# EAGLE design at2313 isp adapter (EAGLE 6.1)
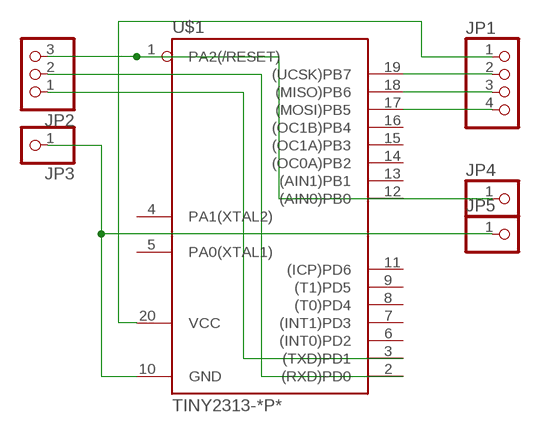
[diagram p0: schematic, sheet 1]

## Parts
JP1  PINHD-1X4  [1X04]
JP2  PINHD-1X3  [1X03]
JP3  PINHD-1X1  [1X01]
JP4  PINHD-1X1  [1X01]
JP5  PINHD-1X1  [1X01]
U$1  TINY2313-*P*  [DIL20]

## Nets
GND: JP3.1 JP5.1 U$1.10(GND)
N$1: JP1.2 U$1.19((UCSK)PB7)
N$2: JP1.3 U$1.18((MISO)PB6)
N$3: JP1.4 U$1.17((MOSI)PB5)
N$4: JP1.1 U$1.20(VCC)
N$6: JP2.3 JP4.1 U$1.1(PA2(/RESET))
N$7: JP2.2 U$1.2((RXD)PD0)
N$8: JP2.1 U$1.3((TXD)PD1)
Unconnected: U$1.4(PA1(XTAL2)) U$1.5(PA0(XTAL1)) U$1.6((INT0)PD2) U$1.7((INT1)PD3) U$1.8((T0)PD4) U$1.9((T1)PD5) U$1.11((ICP)PD6) U$1.12((AIN0)PB0) U$1.13((AIN1)PB1) U$1.14((OC0A)PB2) U$1.15((OC1A)PB3) U$1.16((OC1B)PB4)

## Library data of the parts
JP1 = pinhead:PINHD-1X4: PIN HEADER
JP2 = pinhead:PINHD-1X3: PIN HEADER
JP3-JP5 = pinhead:PINHD-1X1: PIN HEADER
U$1 = avr-7:TINY2313*: Atmel Tiny2313 2K Flash, 128 bytes EEPROM, 128 bytes RAM

## Board
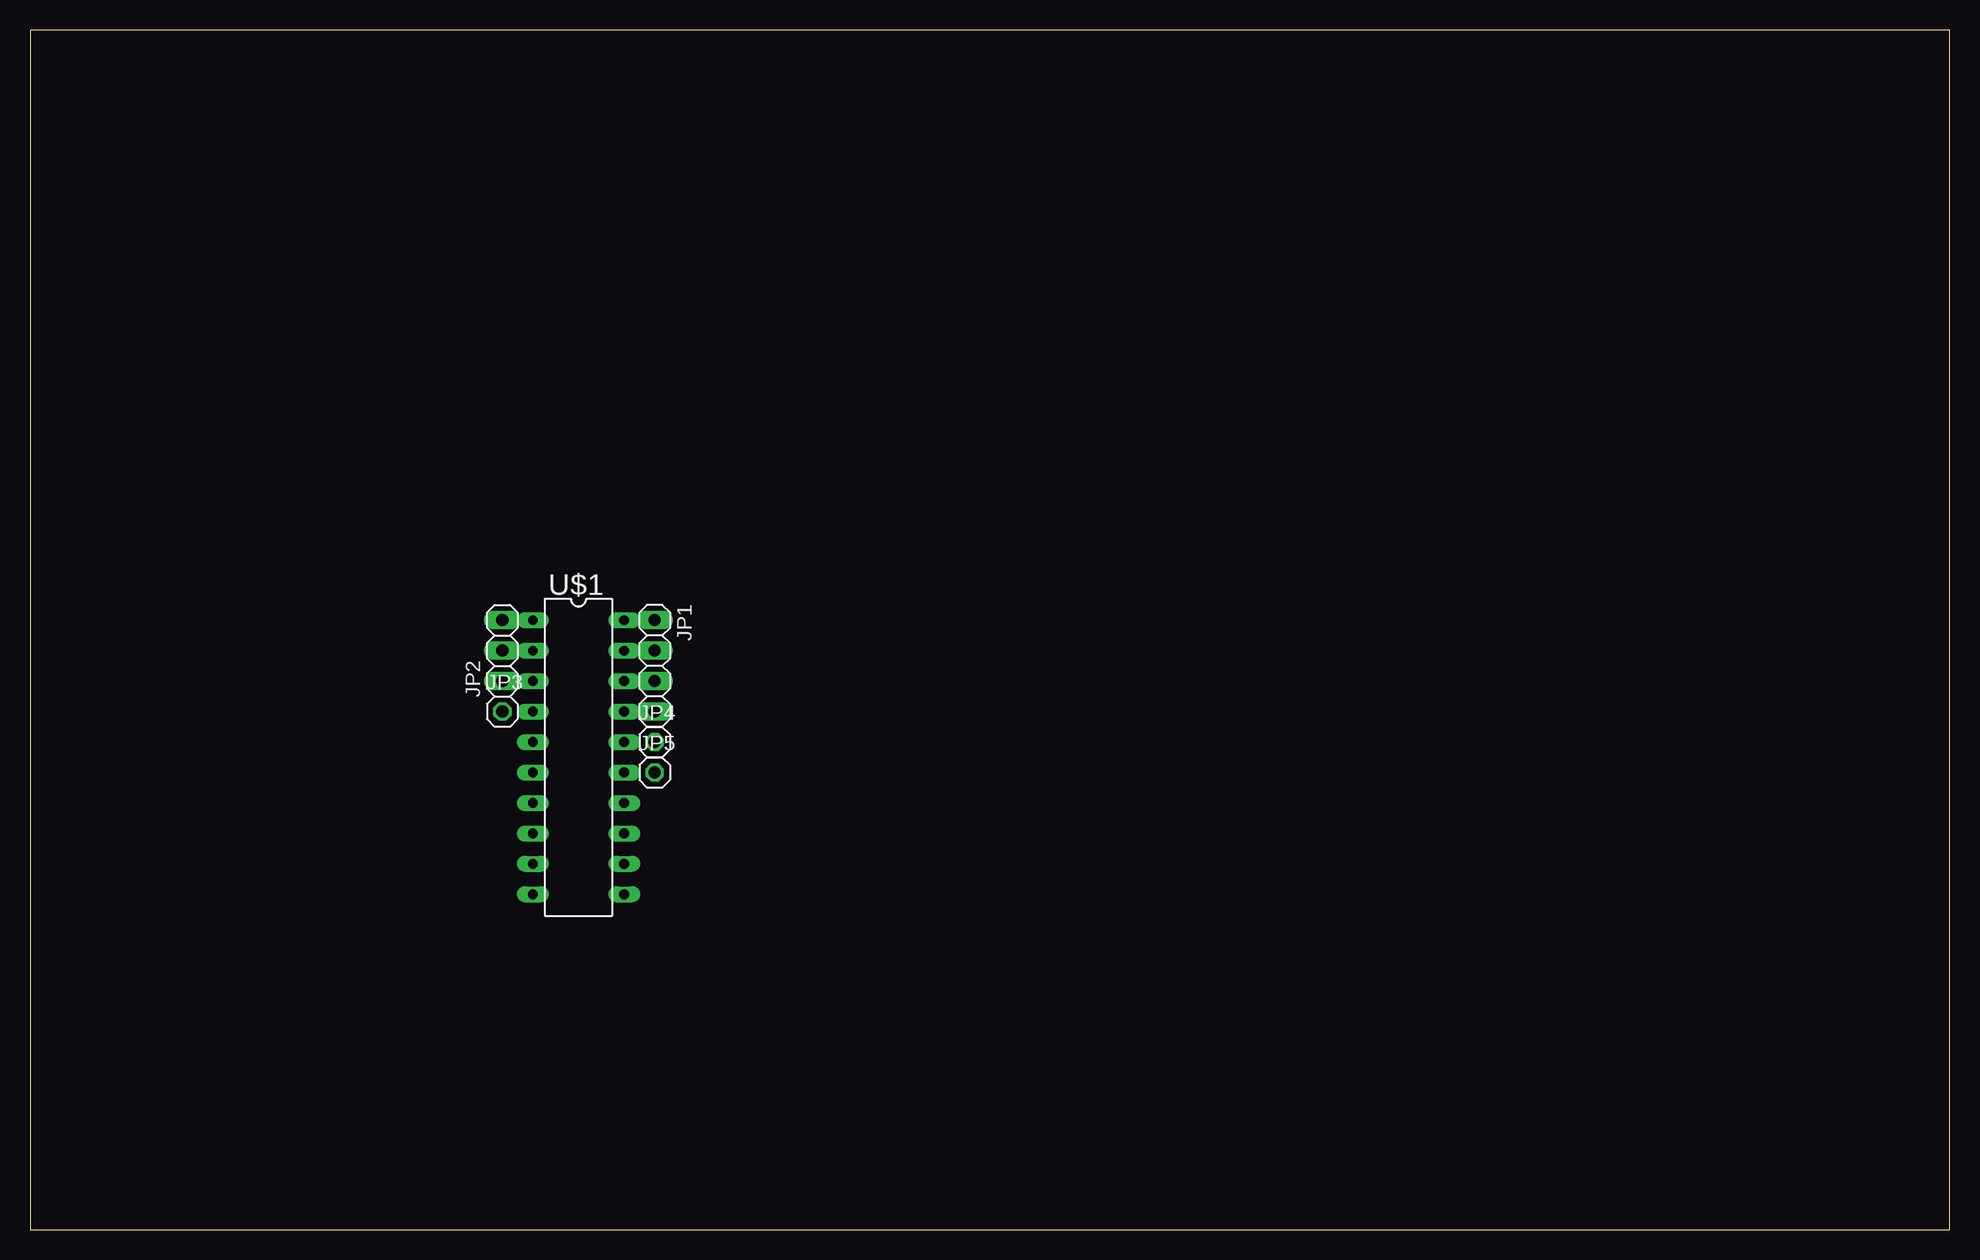
[diagram p1: board, top side]
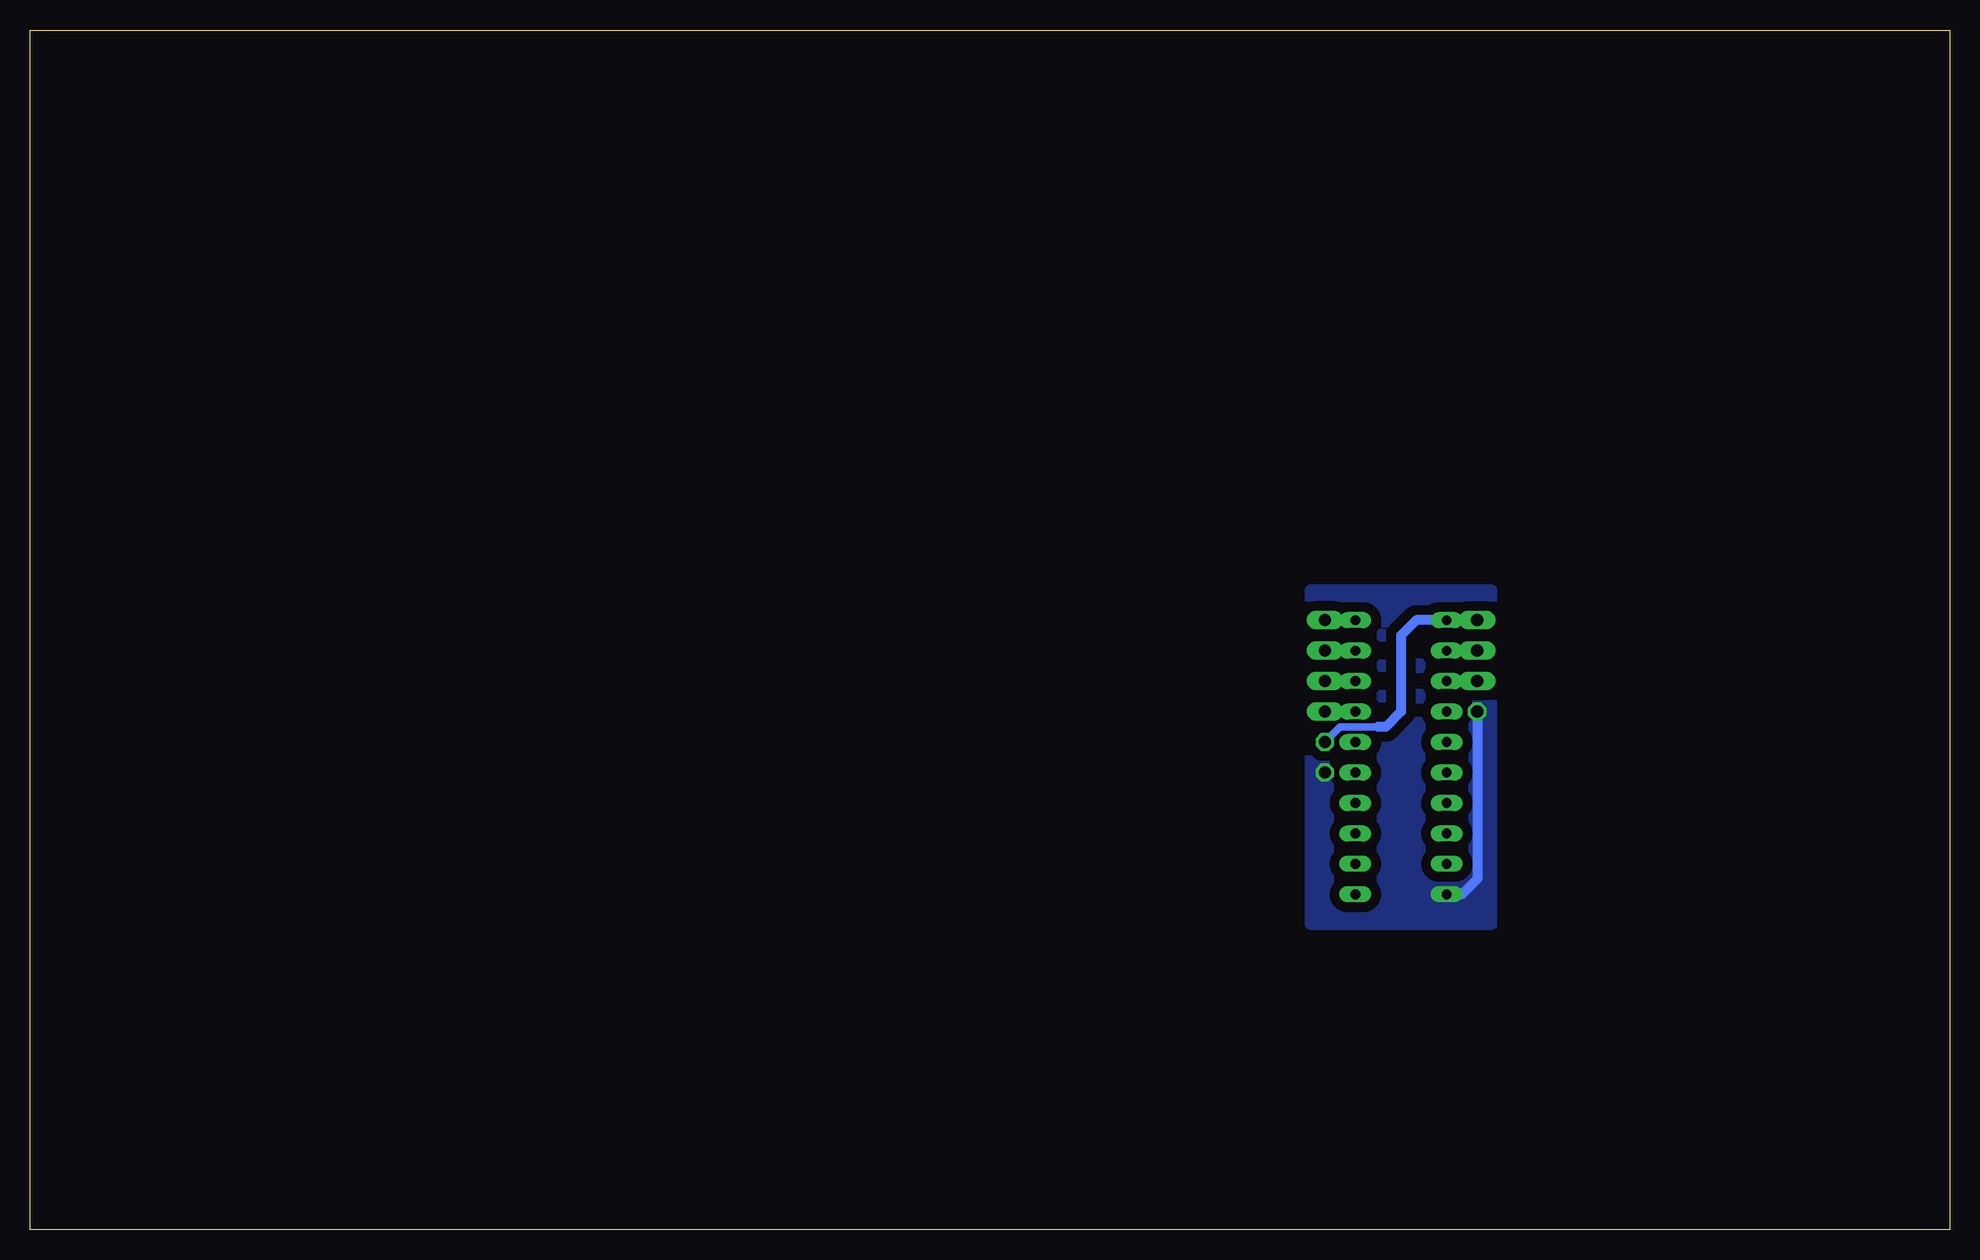
[diagram p2: board, bottom side, seen from below]

Size 160 x 100 mm. Coordinates in mm from the lower left corner, seen from the top.
Outline: 0,0 160,0 160,100 0,100 0,0
Copper layers (1*16): Top 0.035mm / dielectric 1.5mm / Bottom 0.035mm
Design rules: minimum track width 10mil, minimum drill 24mil, track to track 8mil, track to pad 8mil, pad to pad 8mil, via to via 8mil, smd to smd 8mil, copper to edge 40mil, drill to drill 8mil, minimum pad ring 10mil, minimum via ring 8mil, stop-mask expansion 4mil, vias tented up to drill 0mil, thermal gap 10mil

### Footprints (pad centres in the part's own frame; a part is rotated, then mirrored left to right if it is on the bottom)
1X04 = drill 1.016 long: 1 -3.81,0; 2 -1.27,0; 3 1.27,0; 4 3.81,0
1X03 = drill 1.016 long: 1 -2.54,0; 2 0,0; 3 2.54,0
1X01 = drill 1.016 octagon: 1 0,0
DIL20 = drill 0.813 long: 1 -11.43,-3.81; 2 -8.89,-3.81; 3 -6.35,-3.81; 4 -3.81,-3.81; 5 -1.27,-3.81; 6 1.27,-3.81; 7 3.81,-3.81; 8 6.35,-3.81; 9 8.89,-3.81; 10 11.43,-3.81; 11 11.43,3.81; 12 8.89,3.81; 13 6.35,3.81; 14 3.81,3.81; 15 1.27,3.81; 16 -1.27,3.81; 17 -3.81,3.81; 18 -6.35,3.81; 19 -8.89,3.81; 20 -11.43,3.81

### Placement (x,y rotation side)
JP1  52.07,46.99 270 top
JP2  39.37,48.26 90 top
JP3  39.37,43.18 0 top
JP4  52.07,40.64 0 top
JP5  52.07,38.1 0 top
U$1  45.72,39.37 270 top

### Tracks (layer width: path | path; a pad name or v marks a point on that pad's centre or on a via)
GND
  Bottom 0.813: U$1.10 40.64,27.94 39.37,29.21 JP3.1
  pour Bottom (isolate 0.813, no thermals): 38.1,53.34 53.34,53.34 53.34,25.4 38.1,25.4
N$1
  Bottom 0.813: JP1.2 U$1.19
N$2
  Bottom 0.813: U$1.18 JP1.3
N$3
  Bottom 0.813: JP1.4 U$1.17
N$4
  Bottom 0.813: U$1.20 JP1.1
N$6
  Bottom 0.61: 47.62,41.91 50.8,41.91 JP4.1
  Bottom 0.813: JP2.3 U$1.1 44.45,50.8 45.72,49.53 45.72,43.18 46.99,41.91 47.62,41.91
N$7
  Bottom 0.813: U$1.2 JP2.2
N$8
  Bottom 0.813: JP2.1 U$1.3